# Altium schematic sheet martice_relais.SchDoc: matrice à relais
size A3
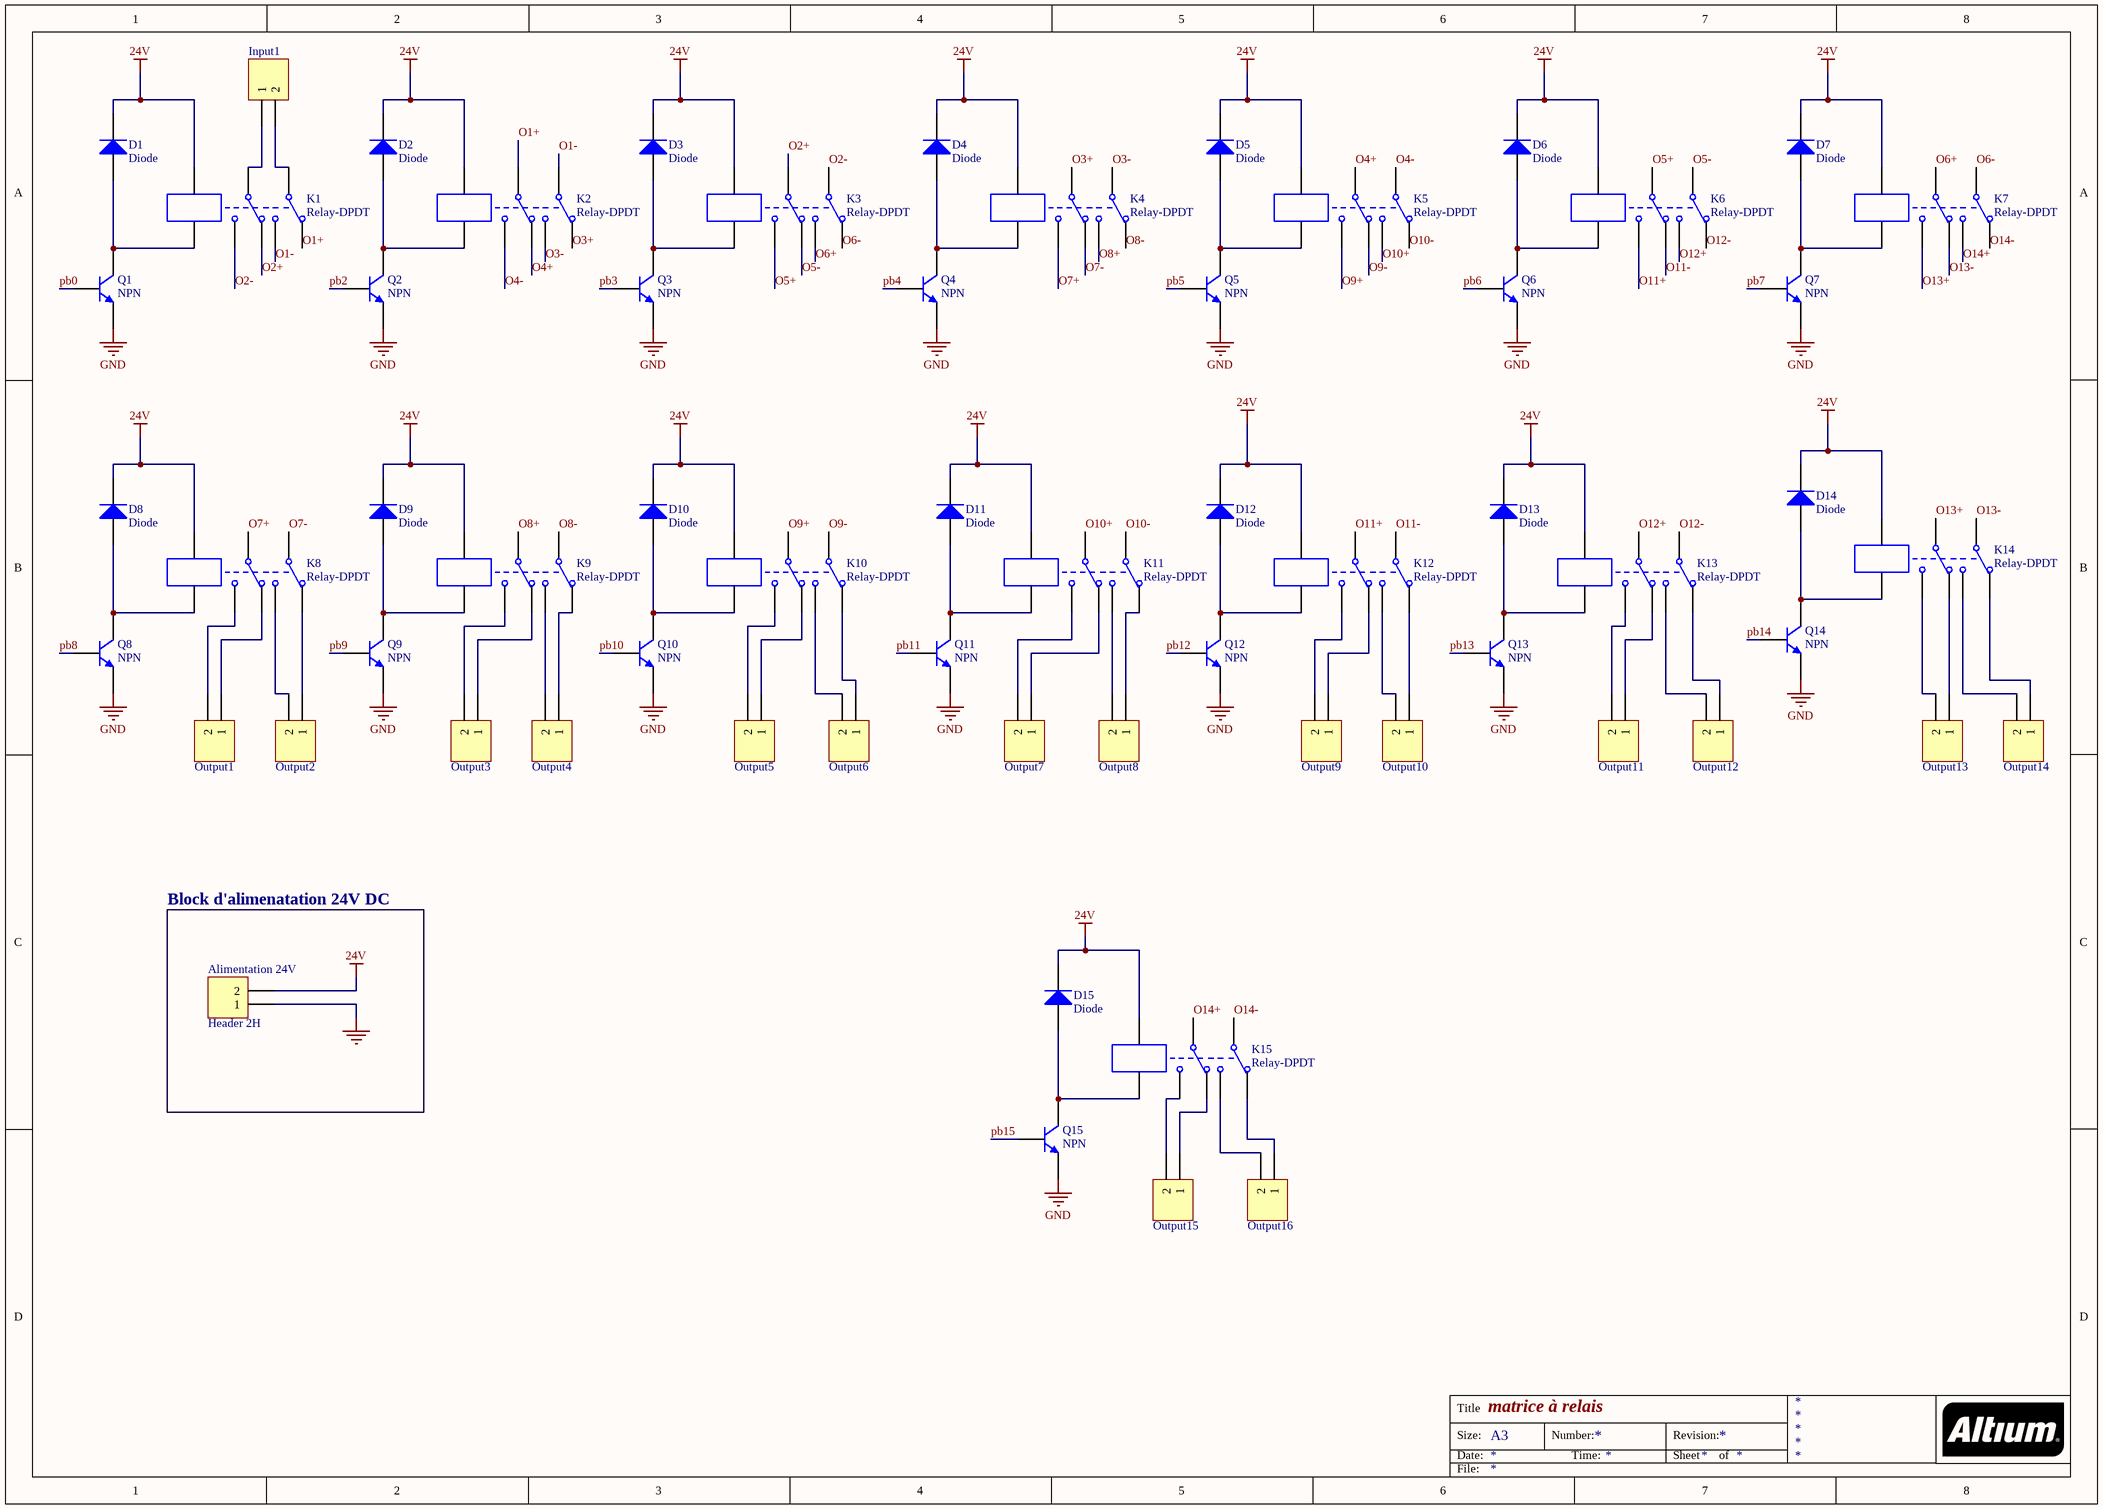
[diagram p0: martice_relais.SchDoc]

## Parts
Alimentation_24V  Header 2H  [HDR1X2H]
D1  Diode  [SMC]
D2  Diode  [SMC]
D3  Diode  [SMC]
D4  Diode  [SMC]
D5  Diode  [SMC]
D6  Diode  [SMC]
D7  Diode  [SMC]
D8  Diode  [SMC]
D9  Diode  [SMC]
D10  Diode  [SMC]
D11  Diode  [SMC]
D12  Diode  [SMC]
D13  Diode  [SMC]
D14  Diode  [SMC]
D15  Diode  [SMC]
Input1  Header 2H  [HDR1X2H]  (value not drawn)
K1  Relay-DPDT  [DIP-P8]
K2  Relay-DPDT  [DIP-P8]
K3  Relay-DPDT  [DIP-P8]
K4  Relay-DPDT  [DIP-P8]
K5  Relay-DPDT  [DIP-P8]
K6  Relay-DPDT  [DIP-P8]
K7  Relay-DPDT  [DIP-P8]
K8  Relay-DPDT  [DIP-P8]
K9  Relay-DPDT  [DIP-P8]
K10  Relay-DPDT  [DIP-P8]
K11  Relay-DPDT  [DIP-P8]
K12  Relay-DPDT  [DIP-P8]
K13  Relay-DPDT  [DIP-P8]
K14  Relay-DPDT  [DIP-P8]
K15  Relay-DPDT  [DIP-P8]
Output1  Header 2H  [HDR1X2H]  (value not drawn)
Output2  Header 2H  [HDR1X2H]  (value not drawn)
Output3  Header 2H  [HDR1X2H]  (value not drawn)
Output4  Header 2H  [HDR1X2H]  (value not drawn)
Output5  Header 2H  [HDR1X2H]  (value not drawn)
Output6  Header 2H  [HDR1X2H]  (value not drawn)
Output7  Header 2H  [HDR1X2H]  (value not drawn)
Output8  Header 2H  [HDR1X2H]  (value not drawn)
Output9  Header 2H  [HDR1X2H]  (value not drawn)
Output10  Header 2H  [HDR1X2H]  (value not drawn)
Output11  Header 2H  [HDR1X2H]  (value not drawn)
Output12  Header 2H  [HDR1X2H]  (value not drawn)
Output13  Header 2H  [HDR1X2H]  (value not drawn)
Output14  Header 2H  [HDR1X2H]  (value not drawn)
Output15  Header 2H  [HDR1X2H]  (value not drawn)
Output16  Header 2H  [HDR1X2H]  (value not drawn)
Q1  NPN  [TO-226-AA]
Q2  NPN  [TO-226-AA]
Q3  NPN  [TO-226-AA]
Q4  NPN  [TO-226-AA]
Q5  NPN  [TO-226-AA]
Q6  NPN  [TO-226-AA]
Q7  NPN  [TO-226-AA]
Q8  NPN  [TO-226-AA]
Q9  NPN  [TO-226-AA]
Q10  NPN  [TO-226-AA]
Q11  NPN  [TO-226-AA]
Q12  NPN  [TO-226-AA]
Q13  NPN  [TO-226-AA]
Q14  NPN  [TO-226-AA]
Q15  NPN  [TO-226-AA]

## Blocks framed on the sheet
Block d'alimenatation 24V DC: Alimentation_24V

## Nets
24V: Alimentation_24V.2 D1.2(K) D2.2(K) D3.2(K) D4.2(K) D5.2(K) D6.2(K) D7.2(K) D8.2(K) D9.2(K) D10.2(K) D11.2(K) D12.2(K) D13.2(K) D14.2(K) D15.2(K) K1.7 K2.7 K3.7 K4.7 K5.7 K6.7 K7.7 K8.7 K9.7 K10.7 K11.7 K12.7 K13.7 K14.7 K15.7
GND: Q1.3(E) Q2.3(E) Q3.3(E) Q4.3(E) Q5.3(E) Q6.3(E) Q7.3(E) Q8.3(E) Q9.3(E) Q10.3(E) Q11.3(E) Q12.3(E) Q13.3(E) Q14.3(E) Q15.3(E)
O1+: K1.2 K2.4
O1-: K1.3 K2.1
O2+: K1.5 K3.4
O2-: K1.6 K3.1
O3+: K2.2 K4.4
O3-: K2.3 K4.1
O4+: K2.5 K5.4
O4-: K2.6 K5.1
O5+: K3.6 K6.4
O5-: K3.5 K6.1
O6+: K3.3 K7.4
O6-: K3.2 K7.1
O7+: K4.6 K8.4
O7-: K4.5 K8.1
O8+: K4.3 K9.4
O8-: K4.2 K9.1
O9+: K5.6 K10.4
O9-: K5.5 K10.1
O10+: K5.3 K11.4
O10-: K5.2 K11.1
O11+: K6.6 K12.4
O11-: K6.5 K12.1
O12+: K6.3 K13.4
O12-: K6.2 K13.1
O13+: K7.6 K14.4
O13-: K7.5 K14.1
O14+: K7.3 K15.4
O14-: K7.2 K15.1
pb0: Q1.2(B)
pb2: Q2.2(B)
pb3: Q3.2(B)
pb4: Q4.2(B)
pb5: Q5.2(B)
pb6: Q6.2(B)
pb7: Q7.2(B)
pb8: Q8.2(B)
pb9: Q9.2(B)
pb10: Q10.2(B)
pb11: Q11.2(B)
pb12: Q12.2(B)
pb13: Q13.2(B)
pb14: Q14.2(B)
pb15: Q15.2(B)
NetD1_1: D1.1(A) K1.8 Q1.1(C)
NetD2_1: D2.1(A) K2.8 Q2.1(C)
NetD3_1: D3.1(A) K3.8 Q3.1(C)
NetD4_1: D4.1(A) K4.8 Q4.1(C)
NetD5_1: D5.1(A) K5.8 Q5.1(C)
NetD6_1: D6.1(A) K6.8 Q6.1(C)
NetD7_1: D7.1(A) K7.8 Q7.1(C)
NetD8_1: D8.1(A) K8.8 Q8.1(C)
NetD9_1: D9.1(A) K9.8 Q9.1(C)
NetD10_1: D10.1(A) K10.8 Q10.1(C)
NetD11_1: D11.1(A) K11.8 Q11.1(C)
NetD12_1: D12.1(A) K12.8 Q12.1(C)
NetD13_1: D13.1(A) K13.8 Q13.1(C)
NetD14_1: D14.1(A) K14.8 Q14.1(C)
NetD15_1: D15.1(A) K15.8 Q15.1(C)
NetInput1_1: Input1.1 K1.4
NetInput1_2: Input1.2 K1.1
NetK8_2: K8.2 Output2.1
NetK8_3: K8.3 Output2.2
NetK8_5: K8.5 Output1.1
NetK8_6: K8.6 Output1.2
NetK9_2: K9.2 Output4.1
NetK9_3: K9.3 Output4.2
NetK9_5: K9.5 Output3.1
NetK9_6: K9.6 Output3.2
NetK10_2: K10.2 Output6.1
NetK10_3: K10.3 Output6.2
NetK10_5: K10.5 Output5.1
NetK10_6: K10.6 Output5.2
NetK11_2: K11.2 Output8.1
NetK11_3: K11.3 Output8.2
NetK11_5: K11.5 Output7.1
NetK11_6: K11.6 Output7.2
NetK12_2: K12.2 Output10.1
NetK12_3: K12.3 Output10.2
NetK12_5: K12.5 Output9.1
NetK12_6: K12.6 Output9.2
NetK13_2: K13.2 Output12.1
NetK13_3: K13.3 Output12.2
NetK13_5: K13.5 Output11.1
NetK13_6: K13.6 Output11.2
NetK14_2: K14.2 Output14.1
NetK14_3: K14.3 Output14.2
NetK14_5: K14.5 Output13.1
NetK14_6: K14.6 Output13.2
NetK15_2: K15.2 Output16.1
NetK15_3: K15.3 Output16.2
NetK15_5: K15.5 Output15.1
NetK15_6: K15.6 Output15.2

Not connected (* = marked no-connect by the designer): Alimentation_24V 1

## Notes on the sheet
- Title
- Size:
- Date:
- A3
- Number:
- Time:
- Revision:
- Sheet
- of
- File:

## Library data of the parts
Alimentation_24V Input1 Output1-Output16 = Header 2H: Header, 2-Pin, Right Angle; LatestRevisionDate: 17-Jul-2002; LatestRevisionNote: Re-released for DXP Platform.; Publisher: Altium Limited
D1-D15 = Diode: Default Diode; Published: 8-Jun-2000; LatestRevisionDate: 17-Jul-2002; LatestRevisionNote: Re-released for DXP Platform.; PackageVersion: Sep-1996; PackageReference: SMC; Publisher: Altium Limited; PackageDescription: DO-214-AB/SMC; 2 C-Bend Leads; Body 7.9 x 5.9 mm, inc. leads (LxW); Code_JEDEC: DO-214-AB
K1-K15 = Relay-DPDT: Dual-Pole Dual-Throw Relay; Published: 24-Mar-1999; LatestRevisionDate: 17-Jul-2002; LatestRevisionNote: Re-released for DXP Platform.; PackageReference: DIP-P8; Publisher: Altium Limited; PackageDescription: Relay; 8 Leads
Q1-Q15 = NPN: NPN Bipolar Transistor; Published: 8-Jun-2000; LatestRevisionDate: 17-Jul-2002; LatestRevisionNote: Re-released for DXP Platform.; PackageReference: TO-226-AA; Publisher: Altium Limited; PackageDescription: TO, Flat Index; 3 In-Line, Axial Leads; Body Dia. 4.8mm; Leads 0.55 x 0.51 mm (max); Code_JEDEC: TO-226-AA